# Altium project UDEMY_ALI_ALCAN.PrjPcb (part 3 of 3)

## Sheet Sensor Board.SchDoc
size A3; ApprovedBy: UDEMY; CheckedBy: Öğrenciler; Revision: AA; SheetNumber: 6; SheetTotal: 6; PageSize: A3; Change Date: 15/09/2023; Rel Date: 15/09/2023; Department: R&D-Hardware; Prepared By: Ali ALCAN; ProjectDescription: Wireless Security Detector
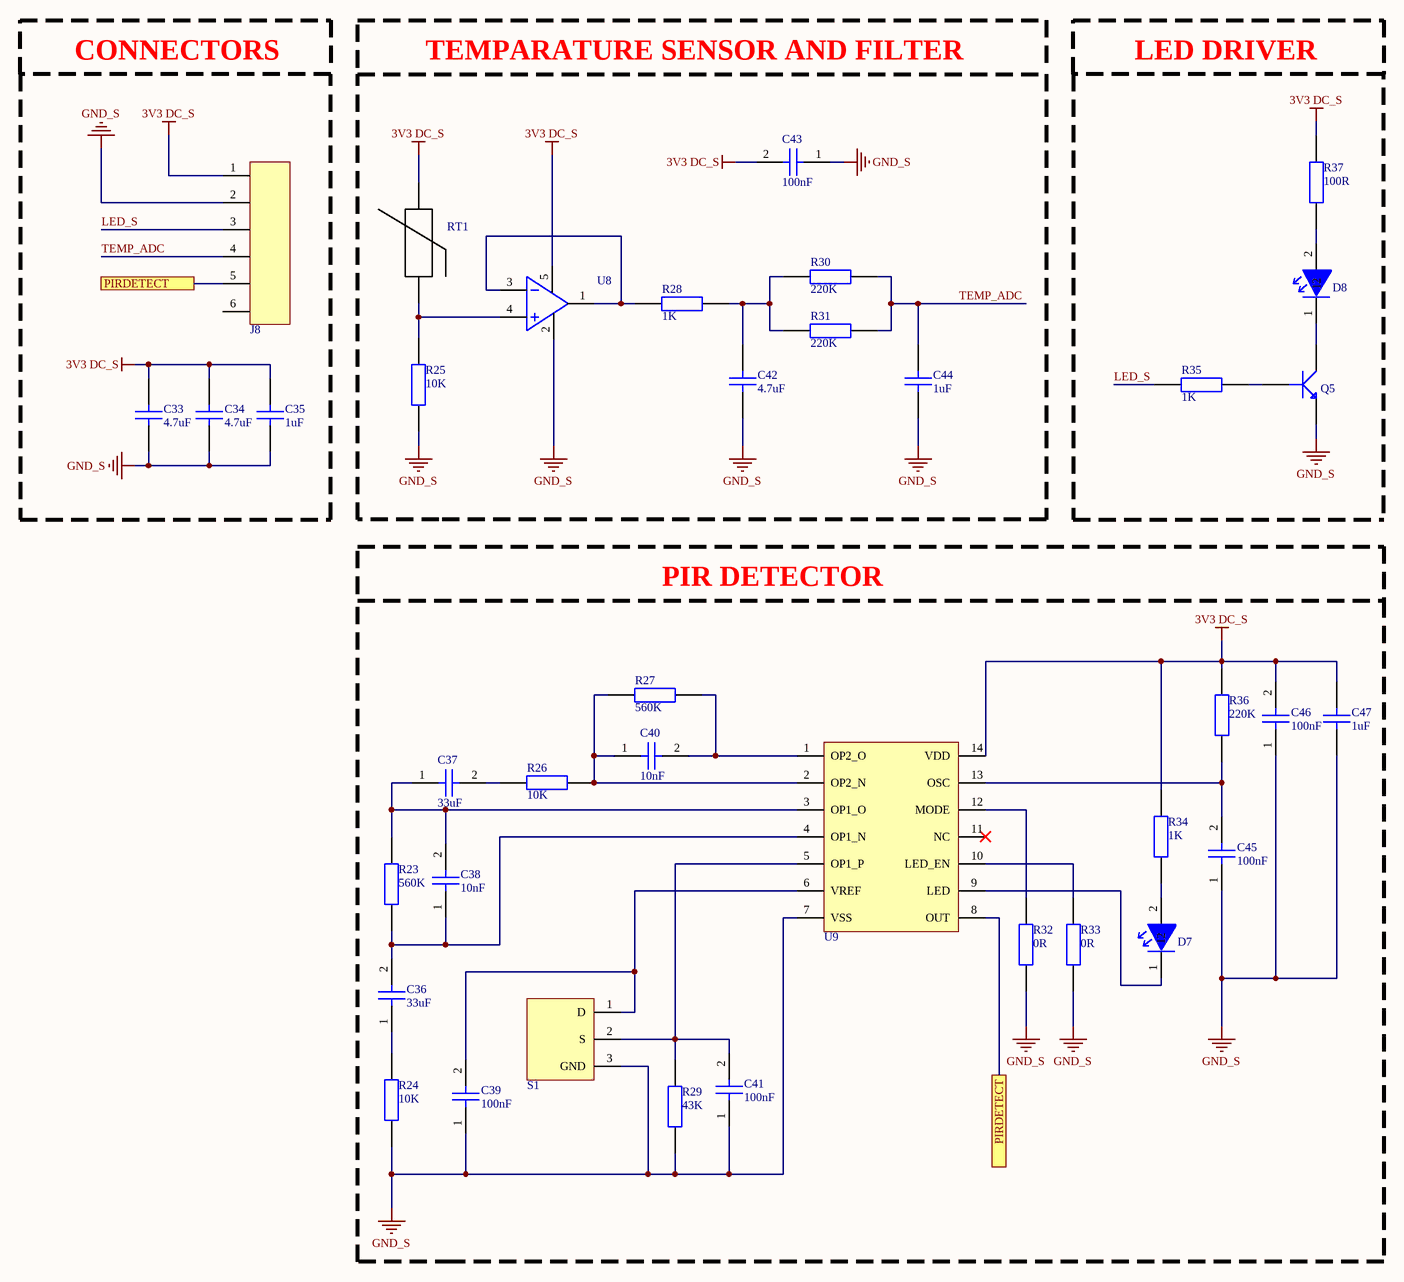
[diagram p4: Sensor Board.SchDoc]

### Parts
C33  value 4.7uF  [CAP_0805]  (hidden comment: CL21A475KAQNNNE)
C34  value 4.7uF  [CAP_0805]  (hidden comment: CL21A475KAQNNNE)
C35  value 1uF  [CAP_0805]  (hidden comment: CL21B105KBFNNNE)
C36  value 33uF  [CAP_1206]  (hidden comment: C3216X5R1E336M160AC)
C37  value 33uF  [CAP_1206]  (hidden comment: C3216X5R1E336M160AC)
C38  value 10nF  [CAP_0603]  (hidden comment: 0603B103K160CT)
C39  value 100nF  [CAP_0603]  (hidden comment: C0603C104K5RACTU)
C40  value 10nF  [CAP_0603]  (hidden comment: 0603B103K160CT)
C41  value 100nF  [CAP_0603]  (hidden comment: C0603C104K5RACTU)
C42  value 4.7uF  [CAP_0805]  (hidden comment: CL21A475KAQNNNE)
C43  value 100nF  [CAP_0603]  (hidden comment: C0603C104K5RACTU)
C44  value 1uF  [CAP_0805]  (hidden comment: CL21B105KBFNNNE)
C45  value 100nF  [CAP_0603]  (hidden comment: C0603C104K5RACTU)
C46  value 100nF  [CAP_0603]  (hidden comment: C0603C104K5RACTU)
C47  value 1uF  [CAP_0805]  (hidden comment: CL21B105KBFNNNE)
D7  LH R974-LP-1-0-20-R18  [LED_GREEN_0805]  (value not drawn)
D8  LH R974-LP-1LH R974-LP-1-0-20-R18  [LED_RED_0805]  (value not drawn)
J8  64800611622  [64800611622]  (value not drawn)
Q5  MMBT3904-7-F  [SOT-23F]  (value not drawn)
R23  value 560K  [RES_0603]  (hidden comment: RC0603JR-07560KL)
R24  value 10K  [RES_0603]  (hidden comment: RC0603FR-0710KL)
R25  value 10K  [RES_0603]  (hidden comment: RC0603FR-0710KL)
R26  value 10K  [RES_0603]  (hidden comment: RC0603FR-0710KL)
R27  value 560K  [RES_0603]  (hidden comment: RC0603JR-07560KL)
R28  value 1K  [RES_0603]  (hidden comment: RC0603JR-071KL)
R29  value 43K  [RES_0603]  (hidden comment: RC0603JR-0743KL)
R30  value 220K  [RES_0603]  (hidden comment: RC0603JR-07220KL)
R31  value 220K  [RES_0603]  (hidden comment: RC0603JR-07220KL)
R32  Resistance: 0R  [RES_0603]  (hidden comment: RC0603JR-070RL)
R33  Resistance: 0R  [RES_0603]  (hidden comment: RC0603JR-070RL)
R34  value 1K  [RES_0603]  (hidden comment: RC0603JR-071KL)
R35  value 1K  [RES_0603]  (hidden comment: RC0603JR-071KL)
R36  value 220K  [RES_0603]  (hidden comment: RC0603JR-07220KL)
R37  value 100R  [RES_0603]  (hidden comment: RC0603JR-07100RL)
RT1  TFPT1206L1002FM  [RES_1206]  (value not drawn)
S1  LHI 878/3902  [LHI 878]  (value not drawn)
U8  OPA314AIDBVR  [SOT23-5]  (value not drawn)
U9  NCS36000DRG  [SOIC14]  (value not drawn)

### Blocks framed on the sheet
CONNECTORS: C33-C35 J8
PIR DETECTOR: C36-C41 C45-C47 D7 R23 R24 R26 R27 R29 R32-R34 R36 S1 U9

### Ports
PIRDETECT (see Sensor Board[3A]), PIRDETECT (see Sensor Board[7D])

### Nets
3V3 DC_S: C33.?2 C34.?2 C35.?2 C43.2 C46.2 C47.?2 J8.1 R34.2 R36.2 R37.2 RT1.2 U8.5 U9.14(VDD)
GND_S: C33.?1 C34.?1 C35.?1 C39.1 C41.1 C42.?1 C43.1 C44.?1 C45.1 C46.1 C47.?1 J8.2 Q5.2(E) R24.1 R25.1 R29.1 R32.1 R33.1 S1.3(GND) U8.2 U9.7(VSS)
LED_S: J8.3 R35.1
TEMP_ADC: C44.?2 J8.4 R30.2 R31.2
NetC36_1: C36.1 R24.2
NetC36_2: C36.2 C38.1 R23.1 U9.4(OP1_N)
NetC37_1: C37.1 C38.2 R23.2 U9.3(OP1_O)
NetC37_2: C37.2 R26.1
NetC39_2: C39.2 S1.1(D) U9.6(VREF)
NetC40_1: C40.1 R26.2 R27.1 U9.2(OP2_N)
NetC40_2: C40.2 R27.2 U9.1(OP2_O)
NetC41_2: C41.2 R29.2 S1.2(S) U9.5(OP1_P)
NetC42_?2: C42.?2 R28.2 R30.1 R31.1
NetC45_2: C45.2 R36.1 U9.13(OSC)
NetD7_1: D7.1 U9.9(LED)
NetD7_2: D7.2 R34.1
NetD8_1: D8.1 Q5.3(C)
NetD8_2: D8.2 R37.1
NetJ8_5: J8.5 U9.8(OUT) ; port PIRDETECT
NetQ5_1: Q5.1(B) R35.2
NetR25_2: R25.2 RT1.1 U8.4
NetR28_1: R28.1 U8.1 U8.3
NetR32_2: R32.2 U9.12(MODE)
NetR33_2: R33.2 U9.10(LED_EN)

Not connected (* = marked no-connect by the designer): J8 6; U9 11(NC)*

### Notes on the sheet
- TEMPARATURE SENSOR AND FILTER
- LED DRIVER
- DocumentName
- Description
- Prepared By
- Rel Date
- Checked By
- Approved By
- Department
- Size
- Revision
- Change Date
- Sheet

### Library data of the parts
C33 C34 C42 = CAP CER 4.7uF 0805: CAP CER 4.7uF 0805 %10; Manufacturer: Samsung; Material: 4241ConductorMaterial; Tolerance: 10%; Voltage Rating: 25V; Dielectric: X5R; Designed by: ALİ; Supplier: Digi-Key; Supplier Part Number: 1276-1244-2-ND; Manufacturer Part Number: CL21A475KAQNNNE; RoHS: Yes; Category: Ceramic Capacitors; Stock: 3903395; Pricing: 2000=0,01856, 4000=0,01698, 10000=0,0158, 14000=0,01501, 50000=0,01303, 100000=0,01077, 200000=0,0105 (USD); Mounting Technology: Surface Mount; Case/Package: 0805; Case Code (Metric): 2012; Case Code (Imperial): 0805; Min Operating Temperature: -55°C; Max Operating Temperature: 85°C; Packaging: Tape and Reel; Voltage Rating (DC): 25V; Series: CL; Construction: Flat; Length: 2mm; Height: 1.25mm; Depth: 1.25mm; Radiation Hardening: No; Lead Free: Lead Free; RoHS Compliant: Yes; ComponentLink1URL: https://datasheet.ciiva.com/25798/cl21a475kaqnnne-25798882.pdf?src-supplier=Digi-Key; ComponentLink1Description: https://datasheet.ciiva.com/25798/cl21a475kaqnnne-25798882.pdf?src-supplier=Digi-Key
C35 C44 C47 = CAP CER 1uF 0805: CAP CER 1uF 0805 %10; Manufacturer: Samsung; Material: 4241ConductorMaterial; Tolerance: 10%; Voltage Rating: 50V; Dielectric: X7R; Designed by: ALİ; Supplier: Digi-Key; Supplier Part Number: 1276-1029-1-ND; Manufacturer Part Number: CL21B105KBFNNNE; RoHS: Yes; Category: Ceramic Capacitors; Stock: 212507; Pricing: 1=0,11, 10=0,079, 50=0,045, 100=0,0373, 500=0,02616, 1000=0,02165 (USD); Mounting Technology: Surface Mount; Case/Package: 0805; Case Code (Metric): 2012; Case Code (Imperial): 0805; Min Operating Temperature: -55°C; Max Operating Temperature: 125°C; Packaging: Tape and Reel; Package Quantity: 1; Voltage: 50V; Series: CL; Construction: Flat; Voltage Rating (DC): 50V; Length: 2mm; Width: 0.049inch; Height: 1.25mm; Thickness: 0.053inch; Depth: 1.25mm; Radiation Hardening: No; RoHS Compliant: Yes; ComponentLink1URL: https://datasheet.ciiva.com/25800/cl21b105kbfnnne-25800291.pdf?src-supplier=Digi-Key; ComponentLink1Description: https://datasheet.ciiva.com/25800/cl21b105kbfnnne-25800291.pdf?src-supplier=Digi-Key; ComponentLink2URL: https://datasheet.ciiva.com/16449/cl21b105kbfnnne-16449003.pdf?src-supplier=Future+Electronics; ComponentLink2Description: https://datasheet.ciiva.com/16449/cl21b105kbfnnne-16449003.pdf?src-supplier=Future+Electronics
C36 C37 = CAP CER 33uF 1206: Multilayer Ceramic Capacitor, 33 uF, 25 V, ± 20%, X5R, 1206 [3216 Metric]; Manufacturer: TDK; Material: 4241ConductorMaterial; Designed by: ALİ; Supplier: Digi-Key; Supplier Part Number: 445-8046-6-ND; Manufacturer Part Number: C3216X5R1E336M160AC; RoHS: Yes; Category: Ceramic Capacitors; Stock: 216892; Pricing: 1=0,96, 10=0,758, 50=0,6564, 100=0,5681, 500=0,42924, 1000=0,37875 (USD); ComponentLink1URL: https://datasheet.ciiva.com/24216/c3216x5r1e336m160ac-265051-24216512.pdf?src-supplier=Mouser; ComponentLink1Description: https://datasheet.ciiva.com/24216/c3216x5r1e336m160ac-265051-24216512.pdf?src-supplier=Mouser; ComponentLink2URL: https://datasheet.ciiva.com/6285/tdkmlcccaprange-6285278.pdf?src-supplier=Digi-Key; ComponentLink2Description: https://datasheet.ciiva.com/6285/tdkmlcccaprange-6285278.pdf?src-supplier=Digi-Key
C38 C40 = CAP CER 10nF 0603: CAP CER 10nF 0603 %10; Manufacturer: Walsin Technologies; Designed by: ALİ; Supplier: Digi-Key; Supplier Part Number: 1292-1384-1-ND; Manufacturer Part Number: 0603B103K160CT; RoHS: Yes; Category: Ceramic Capacitors; Stock: 42393; Pricing: 1=0,1, 10=0,033, 50=0,0182, 100=0,0148, 500=0,0106, 1000=0,00833 (USD); ComponentLink1URL: http://www.farnell.com/datasheets/1958513.pdf?src-supplier=Farnell; ComponentLink1Description: http://www.farnell.com/datasheets/1958513.pdf?src-supplier=Farnell; ComponentLink2URL: http://www.passivecomponent.com/wp-content/uploads/2018/10/MLCC.pdf?src-supplier=Digi-Key; ComponentLink2Description: http://www.passivecomponent.com/wp-content/uploads/2018/10/MLCC.pdf?src-supplier=Digi-Key; ComponentLink3URL: https://datasheet.octopart.com/0603B103K160CT-Walsin-Technologies-datasheet-85392065.pdf?src-supplier=Element14; ComponentLink3Description: https://datasheet.octopart.com/0603B103K160CT-Walsin-Technologies-datasheet-85392065.pdf?src-supplier=Element14; ComponentLink4URL: https://datasheet.octopart.com/0603B103K160CT-Walsin-Technologies-datasheet-136037192.pdf?src-supplier=Future+Electronics; ComponentLink4Description: https://datasheet.octopart.com/0603B103K160CT-Walsin-Technologies-datasheet-136037192.pdf?src-supplier=Future+Electronics; ComponentLink5URL: https://datasheet.octopart.com/0603B103K160CT-Walsin-Technologies-datasheet-62066062.pdf?src-supplier=TME; ComponentLink5Description: https://datasheet.octopart.com/0603B103K160CT-Walsin-Technologies-datasheet-62066062.pdf?src-supplier=TME
C39 C41 C43 C45 C46 = CAP CER 100nF 0603: CAP CER 100nF 0603 %10; Manufacturer: KEMET; Manufacturer Part Number: C0603C104K5RECAUTO; Designed by: ALİ; Tolerance: 10%; Voltage Rating: 50V; Material: 4241ConductorMaterial; Dielectric: X7R; Temperature Coefficient: 30ppm/°C; Supplier: Digi-Key; Supplier Part Number: 399-14105-1-ND; Category: Ceramic Capacitors; Stock: 4649; Pricing: 1=0,21, 10=0,144, 50=0,0864, 100=0,073, 500=0,04992, 1000=0,04416 (USD); Mounting Technology: Surface Mount; Case/Package: 0603; Case Code (Imperial): 0603; Case Code (Metric): 1608; Min Operating Temperature: -55°C; Max Operating Temperature: 125°C; Packaging: Cut Tape; Series: C; Ratings: AEC-Q200; RoHS Compliant: Yes; RoHS: Yes; Voltage: 50V; Length: 0.063inch; Width: 0.031inch; Thickness: 0.034inch; Lead Free: 5697LeadFree
D7 = LED GREEN 0805: Manufacturer: Vishay Lite-On; Manufacturer Part Number: LTST-C17GKT; Designed by: ALİ; Color: Green; Forward Current: 30mA; Forward Voltage: 2.1V; Power Rating: 100mW; Reverrse Voltage: 5V; Lenght: 2mm; Supplier 1: Digi-Key; RoHS: Yes; Category: LEDs; Mount: Surface Mount; Case/Package: 0805; Width: 1.25mm; Height: 0.8mm; Depth: 1.25mm; Supplier Part Number: 160-1423-1-ND
D8 = LED RED 0805: Designed by: ALİ; Reverse Voltage: 5V; lllumination Color: Red; Lens Transparency: Diffused; Luminous Flux: 0.17Im; Lenght: 2.1mm; Lens Size: 1.25mm; Package Quantity: 1; Series: CHipLED; Width: 1.25mm; Depth: 1.35mm; RoHS Compliant: Yes; Supplier Part Number: 475-1415-1-ND
J8 = 64800611622_conn_6pin: 1.50mm 6 Pin Connector; Manufacturer: Wurth Electronics; Supplier: Digi-Key; Supplier Part Number: 732-64800611622-ND; Manufacturer Part Number: 64800611622; RoHS: No; Category: Uncategorized; Stock: 904; Pricing: 1=0,42, 50=0,406, 100=0,384, 250=0,361, 500=0,339 (USD)
Q5 = MMBT3904-7-F: Transistor General Purpose BJT NPN 40 Volt 0.2A Automotive 3-Pin SOT-23; Manufacturer: Diodes Zetex; Designed by: ALİ; Max Power Dissipation: 300mW; Collector Emitter Voltage (VCEO): 40V; Max Collector Current: 200mA; Collector Base Voltage (VCBO): 60V; Power Dissipation: 350mW; Frequency: 300MHz; hFE Min: 100; Number of Elements: 1; Emitter Base Voltage (VEBO): 6V; Collector Emitter Saturation Voltage: 300mV; Supplier: Digi-Key; Supplier Part Number: MMBT3904-FDICT-ND; Manufacturer Part Number: MMBT3904-7-F; RoHS: Yes; Category: BJTs; Stock: 5948624; Pricing: 1=0,12, 10=0,111, 100=0,0607, 500=0,03732, 1000=0,02545 (USD); Mounting Technology: Surface Mount; Case/Package: SOT-23; Pins: 3; Weight: 0.000282oz; Min Operating Temperature: -55°C; Max Operating Temperature: 150°C; Polarity: NPN; Packaging: Tape and Reel; Voltage Rating (DC): 40V; Package Quantity: 3000; Transition Frequency: 300MHz; Collector Emitter Breakdown Voltage: 40V; Max Breakdown Voltage: 40V; Continuous Collector Current: 200mA; Clock Frequency: 300MHz; Gain Bandwidth Product: 300MHz; Series: Automotive, AEC-Q101; Collector-emitter Voltage-Max: 300mV; Length: 3.05mm; Width: 1.4mm; Height: 1mm; Radiation Hardening: No; Reach SVHC Compliant: No; Lead Free: Lead Free; RoHS Compliant: Yes; ComponentLink1URL: https://datasheet.ciiva.com/11201/ds30036-11201778.pdf?src-supplier=Avnet; ComponentLink1Description: https://datasheet.ciiva.com/11201/ds30036-11201778.pdf?src-supplier=Avnet; ComponentLink2URL: https://datasheet.ciiva.com/15138/getdatasheetpartid-53265-15138780.pdf?src-supplier=Verical; ComponentLink2Description: https://datasheet.ciiva.com/15138/getdatasheetpartid-53265-15138780.pdf?src-supplier=Verical; ComponentLink3URL: https://datasheet.ciiva.com/22711/1915516-22711750.pdf?src-supplier=Element14; ComponentLink3Description: https://datasheet.ciiva.com/22711/1915516-22711750.pdf?src-supplier=Element14; ComponentLink4URL: https://datasheet.ciiva.com/11198/ds30036-11198999.pdf?src-supplier=Avnet; ComponentLink4Description: https://datasheet.ciiva.com/11198/ds30036-11198999.pdf?src-supplier=Avnet; ComponentLink5URL: https://datasheet.ciiva.com/6361/ds30036-6361256.pdf?src-supplier=Digi-Key; ComponentLink5Description: https://datasheet.ciiva.com/6361/ds30036-6361256.pdf?src-supplier=Digi-Key; ComponentLink6URL: https://datasheet.ciiva.com/6361/ds30036-6361254.pdf?src-supplier=Digi-Key; ComponentLink6Description: https://datasheet.ciiva.com/6361/ds30036-6361254.pdf?src-supplier=Digi-Key
R23 R27 = RES 560K OHM 0603: SMD Chip Resistor, 560 kOhm, ± 5%, 100 mW, 0603 [1608 Metric], Thick Film, General Purpose; Manufacturer: Yageo; Designed by: ALİ; Power Rating: 100mW; Voltage Rating: 75V; Voltage Rating (DC): 50V; Temperature Coefficient: 100ppm/°C; Supplier: Digi-Key; Supplier Part Number: 311-560KGRCT-ND; Manufacturer Part Number: RC0603JR-07560KL; RoHS: Yes; Category: Chip SMD Resistors; Stock: 501281; Pricing: 1=0,1, 10=0,014, 50=0,0088, 100=0,0073, 500=0,00486, 1000=0,00415 (USD); Case/Package: 0603; Pins: 2; Case Code (Metric): 1608; Case Code (Imperial): 0603; Weight: 7.1E-05oz; Min Operating Temperature: -55°C; Max Operating Temperature: 155°C; Package Quantity: 1; Tolerance: 5%; Packaging: Tape and Reel; Resistor Type: Thick Film; Number of Terminations: 2; Termination: SMD/SMT; Max Power Dissipation: 100mW; Working Voltage: 75V; Features: Moisture Resistant; Series: RC; Resistance Tolerance: 5%; Technology: THICK FILM; Voltage Rating (AC): 50V; Length: 0.063inch; Width: 0.8mm; Height: 0.022inch; Lead Free: Lead Free; RoHS Compliant: Yes; Reach SVHC Compliant: Unknown; ComponentLink1URL: https://datasheet.ciiva.com/2453/pyu-r-int-thick-7-2453056.pdf?src-supplier=Digi-Key; ComponentLink1Description: https://datasheet.ciiva.com/2453/pyu-r-int-thick-7-2453056.pdf?src-supplier=Digi-Key; ComponentLink2URL: https://datasheet.ciiva.com/2453/pyu-r-int-thick-7-2453057.pdf?src-supplier=Digi-Key; ComponentLink2Description: https://datasheet.ciiva.com/2453/pyu-r-int-thick-7-2453057.pdf?src-supplier=Digi-Key; ComponentLink3URL: https://datasheet.ciiva.com/2453/pyu-r-int-thick-7-2453055.pdf?src-supplier=Digi-Key; ComponentLink3Description: https://datasheet.ciiva.com/2453/pyu-r-int-thick-7-2453055.pdf?src-supplier=Digi-Key
R24-R26 = RES 10K OHM 0603: RES 10K %1 OHM 0603 SMD; Manufacturer: Yageo; Designed by: ALİ; Tolerance: 1%; Temperature Coefficient: 100ppm/°C; Voltage Rating (DC): 50V; Power Rating: 100mW; Voltage Rating: 75V; Supplier: Digi-Key; Supplier Part Number: 311-10.0KHRTR-ND; Manufacturer Part Number: RC0603FR-0710KL; RoHS: Yes; Category: Chip SMD Resistors; Stock: 24754690; Pricing: 5000=0,00363, 10000=0,00318, 25000=0,00272, 35000=0,00264, 50000=0,00244, 125000=0,0022 (USD); Case/Package: 0603; Pins: 2; Case Code (Imperial): 0603; Case Code (Metric): 1608; Weight: 7.1E-05oz; Min Operating Temperature: -55°C; Max Operating Temperature: 155°C; Resistor Type: Thick Film; Packaging: Tape and Reel; Termination: SMD/SMT; Features: Moisture Resistant; Series: RC; Max Power Dissipation: 100mW; Number of Terminations: 2; Resistance Tolerance: 1%; Construction: Rectangular; Length: 1.6mm; Width: 0.8mm; Height: 0.45mm; Depth: 0.8mm; Lead Pitch: 0.3mm; Reach SVHC Compliant: No; Lead Free: Lead Free; Military Standard: Not; RoHS Compliant: Yes; ComponentLink1URL: https://datasheet.ciiva.com/7660/38590-7660789.pdf?src-supplier=Element14; ComponentLink1Description: https://datasheet.ciiva.com/7660/38590-7660789.pdf?src-supplier=Element14; ComponentLink2URL: https://datasheet.ciiva.com/7983/443971-7983596.pdf?src-supplier=Element14; ComponentLink2Description: https://datasheet.ciiva.com/7983/443971-7983596.pdf?src-supplier=Element14; ComponentLink3URL: https://datasheet.ciiva.com/22747/443971-22747519.pdf?src-supplier=Element14; ComponentLink3Description: https://datasheet.ciiva.com/22747/443971-22747519.pdf?src-supplier=Element14; ComponentLink4URL: https://datasheet.ciiva.com/46440/1868787-46440891.pdf?src-supplier=Element14; ComponentLink4Description: https://datasheet.ciiva.com/46440/1868787-46440891.pdf?src-supplier=Element14; ComponentLink5URL: https://datasheet.ciiva.com/7746/1738695-7746239.pdf?src-supplier=Element14; ComponentLink5Description: https://datasheet.ciiva.com/7746/1738695-7746239.pdf?src-supplier=Element14; ComponentLink6URL: https://datasheet.ciiva.com/15189/getdatasheetpartid-409289-15189591.pdf?src-supplier=Verical; ComponentLink6Description: https://datasheet.ciiva.com/15189/getdatasheetpartid-409289-15189591.pdf?src-supplier=Verical
R28 R34 R35 = RES 1K OHM 0603: SMD Chip Resistor, 1 kOhm, ± 5%, 100 mW, 0603 [1608 Metric], Thick Film, General Purpose; Manufacturer: Yageo; Temperature Coefficient: 100ppm/°C; Voltage Rating (DC): 50V; Power Rating: 100mW; Body Length: 1.6mm; Designed by: *; Supplier: Digi-Key; Supplier Part Number: 311-1.0KGRCT-ND; Manufacturer Part Number: RC0603JR-071KL; RoHS: Yes; Category: Chip SMD Resistors; Stock: 1163860; Pricing: 1=0,1, 10=0,014, 50=0,0088, 100=0,0073, 500=0,00486, 1000=0,00415 (USD); Case/Package: 0603; Pins: 2; Contact Plating: Tin,Matte; Case Code (Imperial): 0603; Case Code (Metric): 1608; Min Operating Temperature: -55°C; Max Operating Temperature: 155°C; Tolerance: 5%; Resistor Type: Thick Film; Packaging: Tape and Reel; Package Quantity: 5000; Voltage Rating: 50V; Termination: SMD/SMT; Series: RC; Resistance Tolerance: 5%; Construction: Rectangular; Max Power Dissipation: 100mW; Number of Terminations: 2; Voltage Rating (AC): 50V; Length: 1.6mm; Width: 0.8mm; Height: 0.45mm; Depth: 0.8mm; Reach SVHC Compliant: No; Lead Free: Lead Free; Military Standard: Not; RoHS Compliant: Yes
R29 = RES 43K OHM 0603: Res Thick Film 0603 43K Ohm 5% 0.1W(1/10W) ±100ppm/°C Pad SMD T/R; Manufacturer: Yageo; Designed by: ALİ; Supplier: Digi-Key; Supplier Part Number: 311-43KGRCT-ND; Manufacturer Part Number: RC0603JR-0743KL; RoHS: Yes; Category: Chip SMD Resistors; Stock: 290453; Pricing: 1=0,1, 10=0,014, 50=0,0088, 100=0,0073, 500=0,00486, 1000=0,00415 (USD); ComponentLink1URL: https://datasheet.ciiva.com/2453/pyu-r-int-thick-7-2453052.pdf?src-supplier=Digi-Key; ComponentLink1Description: https://datasheet.ciiva.com/2453/pyu-r-int-thick-7-2453052.pdf?src-supplier=Digi-Key; ComponentLink2URL: https://datasheet.ciiva.com/2453/pyu-r-int-thick-7-2453053.pdf?src-supplier=Digi-Key; ComponentLink2Description: https://datasheet.ciiva.com/2453/pyu-r-int-thick-7-2453053.pdf?src-supplier=Digi-Key; ComponentLink3URL: https://datasheet.ciiva.com/2453/pyu-r-int-thick-7-2453054.pdf?src-supplier=Digi-Key; ComponentLink3Description: https://datasheet.ciiva.com/2453/pyu-r-int-thick-7-2453054.pdf?src-supplier=Digi-Key
R30 R31 R36 = RES 220K OHM 0603: SMD Chip Resistor, 220 kOhm, ± 5%, 100 mW, 0603 [1608 Metric], Thick Film, General Purpose; Manufacturer: Yageo; Voltage Rating (AC): 50V; Supplier: Digi-Key; Supplier Part Number: 311-220KGRCT-ND; Manufacturer Part Number: RC0603JR-07220KL; RoHS: Yes; Category: Chip SMD Resistors; Stock: 938120; Pricing: 1=0,1, 10=0,014, 50=0,0088, 100=0,0073, 500=0,00486, 1000=0,00415 (USD); ComponentLink1URL: https://datasheet.ciiva.com/2452/pyu-r-int-thick-7-2452923.pdf?src-supplier=Digi-Key; ComponentLink1Description: https://datasheet.ciiva.com/2452/pyu-r-int-thick-7-2452923.pdf?src-supplier=Digi-Key; ComponentLink2URL: https://datasheet.ciiva.com/2452/pyu-r-int-thick-7-2452924.pdf?src-supplier=Digi-Key; ComponentLink2Description: https://datasheet.ciiva.com/2452/pyu-r-int-thick-7-2452924.pdf?src-supplier=Digi-Key; ComponentLink3URL: https://datasheet.ciiva.com/2452/pyu-r-int-thick-7-2452925.pdf?src-supplier=Digi-Key; ComponentLink3Description: https://datasheet.ciiva.com/2452/pyu-r-int-thick-7-2452925.pdf?src-supplier=Digi-Key
R32 R33 = RES 0 OHM 0603: Zero Ohm Resistor, Jumper, 0603 [1608 Metric], Thick Film, 100 mW, 1 A, Surface Mount; Manufacturer: Yageo; Value: 0mR; Tolerance: 1%; Power Rating: 100mW; Voltage Rating (DC): 50V; Temperature Coefficient: 200ppm/°C; Resistance Tolerance: 5%; Designed by: ALİ; Supplier: Digi-Key; Supplier Part Number: 311-0.0GRCT-ND; Manufacturer Part Number: RC0603JR-070RL; RoHS: Yes; Category: Chip SMD Resistors; Stock: 5412959; Pricing: 1=0,1, 10=0,016, 25=0,0112, 50=0,0086, 100=0,0063, 250=0,0048, 500=0,00386, 1000=0,00284 (USD); Case/Package: 0603; Pins: 2; Contact Plating: Tin,Matte; Case Code (Imperial): 0603; Case Code (Metric): 1608; Min Operating Temperature: -55°C; Max Operating Temperature: 155°C; Resistor Type: Thick Film; Packaging: Tape and Reel; Termination: SMD/SMT; Series: RC; Technology: THICK FILM; Package Quantity: 5000; Voltage Rating: 50V; Features: Moisture Resistant; Max Power Dissipation: 100mW; Number of Terminations: 2; Construction: Rectangular; Length: 1.6mm; Width: 0.8mm; Height: 0.45mm; Depth: 0.8mm; Lead Free: Lead Free; RoHS Compliant: Yes; Reach SVHC Compliant: Unknown; Military Standard: Not
R37 = RES 100 OHM 0603: Res Thick Film 0603 100 Ohm 5% 1/10W ±100ppm/°C Molded SMD SMD Paper T/R; Manufacturer: Yageo; Designed by: ALİ; Voltage Rating (DC): 50V; Power Rating: 100mW; Supplier: Digi-Key; Supplier Part Number: 311-100GRCT-ND; Manufacturer Part Number: RC0603JR-07100RL; RoHS: Yes; Category: Chip SMD Resistors; Stock: 872002; Pricing: 1=0,1, 10=0,014, 50=0,0088, 100=0,0073, 500=0,00486, 1000=0,00415 (USD); Case/Package: 0603; Pins: 2; Contact Plating: Tin,Matte; Case Code (Imperial): 0603; Case Code (Metric): 1608; Min Operating Temperature: -55°C; Max Operating Temperature: 155°C; Tolerance: 5%; Temperature Coefficient: 100ppm/°C; Resistor Type: Thick Film; Packaging: Tape and Reel; Voltage Rating: 50V; Termination: SMD/SMT; Features: Moisture Resistant; Series: RC; Max Power Dissipation: 100mW; Number of Terminations: 2; Construction: Rectangular; Resistance Tolerance: 5%; Length: 1.6mm; Width: 0.8mm; Depth: 0.8mm; Lead Free: Lead Free; Reach SVHC Compliant: Unknown; Military Standard: Not; RoHS Compliant: Yes; ComponentLink1URL: https://datasheet.ciiva.com/7746/443971-7746425.pdf?src-supplier=Element14; ComponentLink1Description: https://datasheet.ciiva.com/7746/443971-7746425.pdf?src-supplier=Element14; ComponentLink2URL: https://datasheet.ciiva.com/7746/443971-7746426.pdf?src-supplier=Element14; ComponentLink2Description: https://datasheet.ciiva.com/7746/443971-7746426.pdf?src-supplier=Element14; ComponentLink3URL: https://datasheet.ciiva.com/8883/pyu-rc0603-51-rohs-l-4-8883047.pdf?src-supplier=Avnet; ComponentLink3Description: https://datasheet.ciiva.com/8883/pyu-rc0603-51-rohs-l-4-8883047.pdf?src-supplier=Avnet; ComponentLink4URL: https://datasheet.ciiva.com/15189/getdatasheetpartid-325207-15189846.pdf?src-supplier=Verical; ComponentLink4Description: https://datasheet.ciiva.com/15189/getdatasheetpartid-325207-15189846.pdf?src-supplier=Verical
RT1 = TFPT1206L1002FM: Thermistor PTC 10K Ohm 1% 1206; Manufacturer: Vishay Dale; Designed by: ALİ; Value: 10kR; Power Rating: 125mW; Voltage: 40V; Supplier: Digi-Key; Supplier Part Number: 541-3533-1-ND; Manufacturer Part Number: TFPT1206L1002FM; RoHS: Yes; Category: Thermistors; Stock: 168; Pricing: 1=1,3, 10=0,973, 25=0,778, 100=0,7133, 500=0,59978, 1000=0,53495 (USD); Mounting Technology: Surface Mount; Case/Package: 1206; Case Code (Imperial): 1206; Min Operating Temperature: -55°C; Max Operating Temperature: 125°C; Packaging: Tape and Reel; Package Quantity: 5000; Tolerance: 1%; Max Power Dissipation: 125mW; Termination: SMD/SMT; Series: TFPT; Resistance Tolerance: 1%; Length: 3.2mm; Width: 1.6mm; Height: 0.55mm; Lead Free: Lead Free; RoHS Compliant: Yes; ComponentLink1URL: https://datasheet.ciiva.com/2852/tfpt-2852076.pdf?src-supplier=Digi-Key; ComponentLink1Description: https://datasheet.ciiva.com/2852/tfpt-2852076.pdf?src-supplier=Digi-Key
S1 = LHI 878/3902: SENSOR PYRO DETECTOR DUAL MOTION; Designed by: ALİ; Max Supply Voltage: 12; Min Supply Voltage: 2; Type: Pyro Detector; Supplier 1: Digi-Key; Supplier Part Number: 1601-LHI878/3902-ND; Case/Package: LHI
U8 = OPA314: OP AMP OPA314; Manufacturer: Texas Instruments; Designed by: ALİ; Supplier: Digi-Key; Supplier Part Number: 296-36699-1-ND; Manufacturer Part Number: OPA314AIDBVR; RoHS: Yes; Category: Amplifiers - Op Amps, Buffer, Instrumentation; Stock: 9278; Pricing: 1=1,16, 10=1,034, 25=0,9812, 100=0,8061, 250=0,75352, 500=0,6659, 1000=0,5257 (USD); ComponentLink1URL: https://datasheet.ciiva.com/29638/opa314-29638827.pdf?src-supplier=Digi-Key; ComponentLink1Description: https://datasheet.ciiva.com/29638/opa314-29638827.pdf?src-supplier=Digi-Key; ComponentLink2URL: https://datasheet.ciiva.com/14462/opa2314-14462006.pdf?src-supplier=Avnet; ComponentLink2Description: https://datasheet.ciiva.com/14462/opa2314-14462006.pdf?src-supplier=Avnet; ComponentLink3URL: https://datasheet.ciiva.com/14456/opa2314-14456281.pdf?src-supplier=Avnet; ComponentLink3Description: https://datasheet.ciiva.com/14456/opa2314-14456281.pdf?src-supplier=Avnet
U9 = NCS36000: PIR Controller NCS36000 Series Single 5.75V Passive Infrared Detector Controller (PIR) -SOIC-14; Manufacturer: ON Semiconductor; Designed by: ALİ; Supplier: Digi-Key; Supplier Part Number: NCS36000DRGOSCT-ND; Manufacturer Part Number: NCS36000DRG; RoHS: Yes; Category: Amplifiers - Op Amps, Buffer, Instrumentation; Stock: 18514; Pricing: 1=1,1, 10=0,983, 25=0,9332, 100=0,7166, 250=0,63328, 500=0,59994, 1000=0,46662 (USD); ComponentLink1URL: https://datasheet.ciiva.com/1781/ncs36000-d-1781637.pdf?src-supplier=Digi-Key; ComponentLink1Description: https://datasheet.ciiva.com/1781/ncs36000-d-1781637.pdf?src-supplier=Digi-Key; ComponentLink2URL: https://datasheet.ciiva.com/4763/ncs36000-d-89569-4763639.pdf?src-supplier=Mouser; ComponentLink2Description: https://datasheet.ciiva.com/4763/ncs36000-d-89569-4763639.pdf?src-supplier=Mouser; ComponentLink3URL: https://datasheet.ciiva.com/1781/ncs36000-d-1781638.pdf?src-supplier=Digi-Key; ComponentLink3Description: https://datasheet.ciiva.com/1781/ncs36000-d-1781638.pdf?src-supplier=Digi-Key; ComponentLink4URL: https://datasheet.ciiva.com/1781/ncs36000-d-1781639.pdf?src-supplier=Digi-Key; ComponentLink4Description: https://datasheet.ciiva.com/1781/ncs36000-d-1781639.pdf?src-supplier=Digi-Key; ComponentLink5URL: https://datasheet.ciiva.com/2965/ncs36000-d-2965212.pdf?src-supplier=Avnet; ComponentLink5Description: https://datasheet.ciiva.com/2965/ncs36000-d-2965212.pdf?src-supplier=Avnet; ComponentLink6URL: https://datasheet.ciiva.com/2966/ncs36000-d-2966525.pdf?src-supplier=Avnet; ComponentLink6Description: https://datasheet.ciiva.com/2966/ncs36000-d-2966525.pdf?src-supplier=Avnet

## Nets that join several sheets
3V3 DC: Power Management (8 pins), Microcontroller (23 pins)
5V DC: Power Management (9 pins), Microcontroller (BZ1.2 C18.?2)
GND: Power Management (28 pins), Microcontroller (33 pins)
LED_DRIVER: Power Management (J6.3), Microcontroller (U3.21)
NetJ6_5: Power Management (J6.5), Microcontroller (U3.22)
NetR2_1: Power Management (R2.1), Microcontroller (U3.41)
NetR4_1: Power Management (R4.1), Microcontroller (U3.40)
SWCLK: Power Management (J7.3), Microcontroller (U3.37)
SWDIO: Power Management (J7.2), Microcontroller (U3.34)
TDI: Power Management (J7.4), Microcontroller (U3.38)
TEMPARATURE_ADC: Power Management (J6.4), Microcontroller (U3.19)
USB_N: Power Management (USB1.2), Microcontroller (R11.2 U4.1 U4.6)
USB_P: Power Management (USB1.3), Microcontroller (R12.2 U4.3 U4.4)

## Assembly variants
220V_Sebeke_Girisli: all parts fitted
12V_Adaptor_Girisli: not fitted BR1 C9 C10 D2 F1 J3 R1 T1